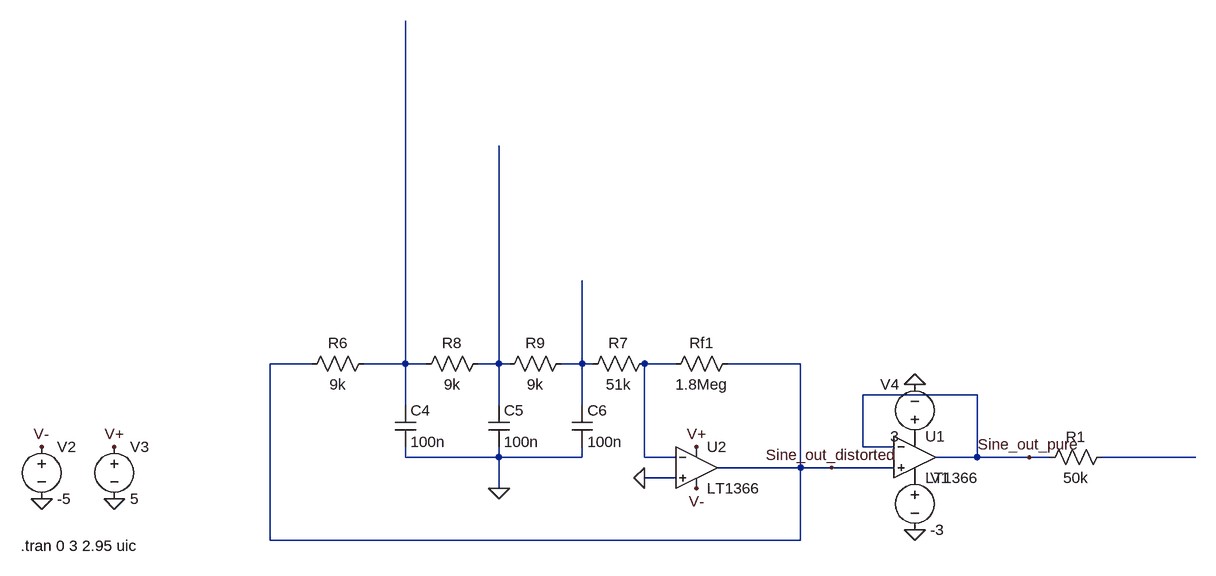
[diagram p0: schematic Draft32.asc]
Draft32.asc, the LTspice schematic file:
Version 4
SHEET 1 1284 680
WIRE -208 -592 -272 -592
WIRE -64 -592 -64 -1120
WIRE -64 -592 -128 -592
WIRE -32 -592 -64 -592
WIRE 80 -592 80 -928
WIRE 80 -592 48 -592
WIRE 96 -592 80 -592
WIRE 208 -592 208 -720
WIRE 208 -592 176 -592
WIRE 224 -592 208 -592
WIRE 352 -592 304 -592
WIRE 544 -592 432 -592
WIRE 816 -544 640 -544
WIRE -64 -528 -64 -592
WIRE 80 -528 80 -592
WIRE 208 -528 208 -592
WIRE 640 -464 640 -544
WIRE 688 -464 640 -464
WIRE -64 -448 -64 -464
WIRE 80 -448 80 -464
WIRE 80 -448 -64 -448
WIRE 208 -448 208 -464
WIRE 208 -448 80 -448
WIRE 304 -448 304 -592
WIRE 352 -448 304 -448
WIRE 816 -448 816 -544
WIRE 816 -448 752 -448
WIRE 896 -448 816 -448
WIRE 928 -448 896 -448
WIRE 1152 -448 1008 -448
WIRE 544 -432 544 -592
WIRE 544 -432 416 -432
WIRE 592 -432 544 -432
WIRE 688 -432 592 -432
WIRE 352 -416 304 -416
WIRE 80 -400 80 -448
WIRE -272 -320 -272 -592
WIRE 544 -320 544 -432
WIRE 544 -320 -272 -320
FLAG -624 -384 0
FLAG -512 -384 0
FLAG -512 -464 V+
FLAG -624 -464 V-
FLAG 384 -400 V-
FLAG 384 -464 V+
FLAG 592 -432 Sine_out_distorted
FLAG 304 -416 0
FLAG 80 -400 0
FLAG 896 -448 Sine_out_pure
FLAG 720 -560 0
FLAG 720 -336 0
SYMBOL voltage -624 -480 R0
SYMATTR InstName V2
SYMATTR Value -5
SYMBOL voltage -512 -480 R0
SYMATTR InstName V3
SYMATTR Value 5
SYMBOL LT1366 384 -496 R0
SYMATTR InstName U2
SYMBOL res 448 -608 R90
WINDOW 0 0 56 VBottom 2
WINDOW 3 32 56 VTop 2
SYMATTR InstName Rf1
SYMATTR Value 1.8Meg
SYMBOL cap -80 -528 R0
SYMATTR InstName C4
SYMATTR Value 100n
SYMBOL res -112 -608 R90
WINDOW 0 0 56 VBottom 2
WINDOW 3 32 56 VTop 2
SYMATTR InstName R6
SYMATTR Value 9k
SYMBOL res 320 -608 R90
WINDOW 0 0 56 VBottom 2
WINDOW 3 32 56 VTop 2
SYMATTR InstName R7
SYMATTR Value 51k
SYMBOL cap 64 -528 R0
SYMATTR InstName C5
SYMATTR Value 100n
SYMBOL cap 192 -528 R0
SYMATTR InstName C6
SYMATTR Value 100n
SYMBOL res 64 -608 R90
WINDOW 0 0 56 VBottom 2
WINDOW 3 32 56 VTop 2
SYMATTR InstName R8
SYMATTR Value 9k
SYMBOL res 192 -608 R90
WINDOW 0 0 56 VBottom 2
WINDOW 3 32 56 VTop 2
SYMATTR InstName R9
SYMATTR Value 9k
SYMBOL LT1366 720 -512 R0
SYMATTR InstName U1
SYMBOL res 1024 -464 R90
WINDOW 0 0 56 VBottom 2
WINDOW 3 32 56 VTop 2
SYMATTR InstName R1
SYMATTR Value 50k
SYMBOL voltage 720 -432 R0
SYMATTR InstName V1
SYMATTR Value -3
SYMBOL voltage 720 -464 R180
WINDOW 0 24 96 Left 2
WINDOW 3 24 16 Left 2
SYMATTR InstName V4
SYMATTR Value 3
TEXT -656 -312 Left 2 !.tran 0 3 2.95 uic

The netlist it stands for:
* Draft32.asc
V2 V- 0 -5
V3 V+ 0 5
XU2 0 N004 V+ V- Sine_out_distorted LT1366  ; pins In+ In- V+ V- OUT
Rf1 Sine_out_distorted N004 1.8Meg
C4 N001 0 100n
R6 N001 Sine_out_distorted 9k
R7 N004 N003 51k
C5 N002 0 100n
C6 N003 0 100n
R8 N002 N001 9k
R9 N003 N002 9k
XU1 Sine_out_distorted Sine_out_pure P001 P002 Sine_out_pure LT1366  ; pins In+ In- V+ V- OUT
R1 N005 Sine_out_pure 50k
V1 P002 0 -3
V4 P001 0 3
.tran 0 3 2.95 uic
.lib LTC.lib
.backanno
.end